# Altium schematic sheet flyback.SchDoc
size Legal; SheetNumber: 4
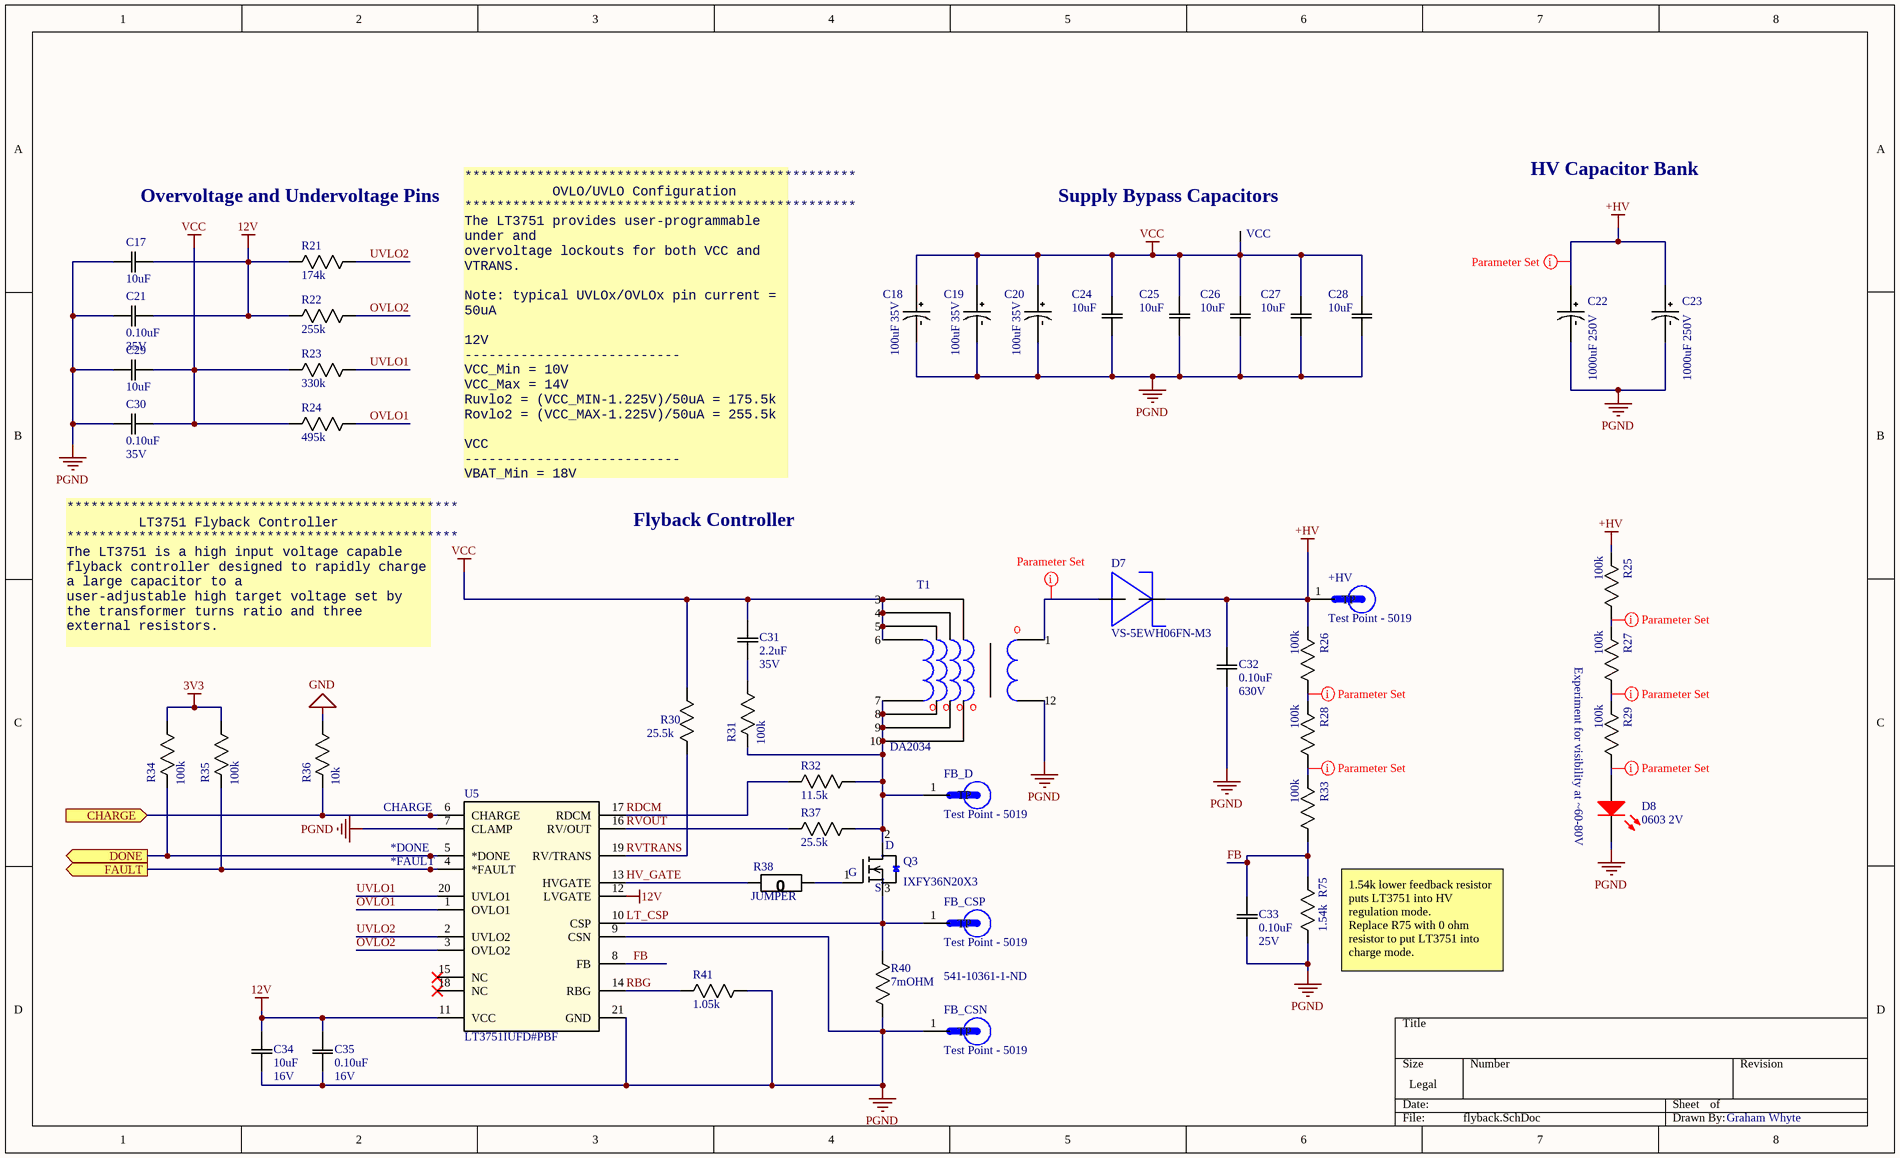
[diagram p0: flyback.SchDoc]

## Parts
*DONE  Test Point (Via)  [TP]  (value not drawn)  (no BOM)
*FAULT  Test Point (Via)  [TP]  (value not drawn)  (no BOM)
+HV  Test Point - 5019  [TP380X203]
C17  10uF  [0805]
C18  100uF 35V  [CAP POL ALU 6.3x5.8]
C19  100uF 35V  [CAP POL ALU 6.3x5.8]
C20  100uF 35V  [CAP POL ALU 6.3x5.8]
C21  Rating: 35V  [0805]  (hidden comment: 0.10uF)
C22  1000uF 250V  [RADIAL, CAN - THRU 25.4mm]
C23  1000uF 250V  [RADIAL, CAN - THRU 25.4mm]
C24  10uF  [0805]
C25  10uF  [0805]
C26  10uF  [0805]
C27  10uF  [0805]
C28  10uF  [0805]
C29  10uF  [0805]
C30  Rating: 35V  [0805]  (hidden comment: 0.10uF)
C31  Rating: 35V  [0603]  (hidden comment: 2.2uF)
C32  Rating: 630V  [1210]  (hidden comment: 0.10uF)
C33  value 0.10uF  Rating: 25V  [0805]  (hidden comment: 0.10uF 25V)
C34  Rating: 16V  [0603]  (hidden comment: 10uF)
C35  Rating: 16V  [0603]  (hidden comment: 0.10uF)
CHARGE  Test Point (Via)  [TP]  (value not drawn)  (no BOM)
D7  VS-5EWH06FN-M3  [DPAK (TO-252)]
D8  0603 2V  [0603 - LED2]
FB_CSN  Test Point - 5019  [TP380X203]
FB_CSP  Test Point - 5019  [TP380X203]
FB_D  Test Point - 5019  [TP380X203]
Q3  IXFY36N20X3  [DPAK (TO-252)]
R21  174k  [0603]
R22  255k  [0603]
R23  330k  [0603]
R24  495k  [0603]
R25  100k  [0603]
R26  100k  [0603]
R27  100k  [0603]
R28  100k  [0603]
R29  100k  [0603]
R30  25.5k  [0603]
R31  100k  [0603]
R32  11.5k  [0603]
R33  100k  [0603]
R34  100k  [0603]
R35  100k  [0603]
R36  10k  [0603]
R37  25.5k  [0603]
R38  JUMPER  [0603]
R40  7mOHM  Supplier Part Number 1: 541-10361-1-ND  [2512]
R41  1.05k  [0603]
R75  1.54k  [0603]
T1  DA2034  [DA2034]
U5  LT3751IUFD#PBF  [QFN-20_UFD_LIT-M]
VCC  Test Point (Via)  [TP]  (value not drawn)  (no BOM)

## Ports
CHARGE (in), DONE (out), FAULT (out)

## Nets
3V3: R34.1(R1) R35.1(R1)
12V: C17.2(C2) C21.2(C2) C34.1(C1) C35.2(C2) R21.2(R2) R22.2(R2) U5.11(VCC) U5.12(LVGATE)
+HV: +HV.1(TP) C22.POS C23.POS C32.1(C1) D7.OUT R25.2(R2) R26.2(R2)
GND: R36.1(R1)
PGND: C17.1(C1) C18.NEG C19.NEG C20.NEG C21.1(C1) C22.NEG C23.NEG C24.1(C1) C25.1(C1) C26.1(C1) C27.1(C1) C28.1(C1) C29.1(C1) C30.1(C1) C32.2(C2) C33.2(C2) C34.2(C2) C35.1(C1) D8.2(K) FB_CSN.1(TP) R40.1(R1) R41.1(R1) R75.1(R1) T1.12 U5.7(CLAMP) U5.9(CSN) U5.21(GND)
VCC: C18.POS C19.POS C20.POS C24.2(C2) C25.2(C2) C26.2(C2) C27.2(C2) C28.2(C2) C29.2(C2) C30.2(C2) C31.2(C2) R23.2(R2) R24.2(R2) R30.1(R1) T1.3 T1.4 T1.5 T1.6 VCC.1
CHARGE: CHARGE.1 R36.2(R2) U5.6(CHARGE) ; port CHARGE
DONE: *DONE.1 R34.2(R2) U5.5(*DONE) ; port DONE
FAULT: *FAULT.1 R35.2(R2) U5.4(*FAULT) ; port FAULT
FB: C33.1(C1) R33.1(R1) R75.2(R2) U5.8(FB)
HV_GATE: R38.2(R2) U5.13(HVGATE)
LT_CSP: FB_CSP.1(TP) Q3.3(S) R40.2(R2) U5.10(CSP)
OVLO1: R24.1(R1) U5.1(OVLO1)
OVLO2: R22.1(R1) U5.3(OVLO2)
RBG: R41.2(R2) U5.14(RBG)
RDCM: R32.2(R2) U5.17(RDCM)
RVOUT: R37.2(R2) U5.16(RV/OUT)
RVTRANS: R30.2(R2) U5.19(RV/TRANS)
UVLO1: R23.1(R1) U5.20(UVLO1)
UVLO2: R21.1(R1) U5.2(UVLO2)
NetC31_1: C31.1(C1) R31.1(R1)
NetD7_IN: D7.IN T1.1
NetD8_1: D8.1(A) R29.1(R1)
NetFB_D_1: FB_D.1(TP) Q3.2(D) R31.2(R2) R32.1(R1) R37.1(R1) T1.7 T1.8 T1.9 T1.10
NetQ3_1: Q3.1(G) R38.1(R1)
NetR25_1: R25.1(R1) R27.2(R2)
NetR26_1: R26.1(R1) R28.2(R2)
NetR27_1: R27.1(R1) R29.2(R2)
NetR28_1: R28.1(R1) R33.2(R2)

Not connected (* = marked no-connect by the designer): U5 15(NC)* 18(NC)*

## Layout directives
net class HighVoltage: +HV, NetD7_IN, NetD8_1, NetR25_1, NetR26_1, NetR27_1, NetR28_1

## Notes on the sheet
- Overvoltage and Undervoltage Pins
- (near VCC) Supply Bypass Capacitors
- HV Capacitor Bank
- *************************************************
  OVLO/UVLO Configuration
  *************************************************
  The LT3751 provides user-programmable under and
  overvoltage lockouts for both VCC and VTRANS.
  Note: typical UVLOx/OVLOx pin current = 50uA
  12V
  ---------------------------
  VCC_Min = 10V
  VCC_Max = 14V
  Ruvlo2 = (VCC_MIN-1.225V)/50uA = 175.5k
  Rovlo2 = (VCC_MAX-1.225V)/50uA = 255.5k
  VCC
  ---------------------------
  VBAT_Min = 18V
  VBAT_Max = 26V
  Ruvlo1 = (VBAT_MIN-1.225V)/50uA = 335.5k
  Rovlo1 = (VBAT_MAX-1.225V)/50uA = 495.5k
- Flyback Controller
- *************************************************
  LT3751 Flyback Controller
  *************************************************
  The LT3751 is a high input voltage capable flyback controller designed to rapidly charge a large capacitor to a
  user-adjustable high target voltage set by the transformer turns ratio and three external resistors.
- Experiment for visibility at ~60-80V
- 1.54k lower feedback resistor puts LT3751 into HV regulation mode.
  Replace R75 with 0 ohm resistor to put LT3751 into charge mode.
- Graham Whyte

## Library data of the parts
+HV FB_CSN FB_CSP FB_D = Test Point - 5019: PC Test Point, Miniature Phosphor Bronze, Silver Plating Surface Mount Mounting Type; MP: 5019; MF: Keystone Electronics; Value: *; Package: 2010 Keystone; Part Number: Test Point - 5019
C17 C24-C29 = CAP 10uF 35V: CAP CER 10UF 35V X7R 0805; Manufacturer Part Number 1: GRM21BR6YA106KE43L; Tolerance: 10%; Temperature Coefficient: X5R; Package: 0805; Value: 10uF; Rating: 35V; Operating Temperature: -55°C ~ 125°C; Part Number: CAP 10uF 35V; Supplier 1: Digi-Key; Supplier Part Number 1: 490-10514-1-ND
C18-C20 = CAP POL 100uF SMD: CAP ALUM 100UF 35V SMD; Tolerance: 20%; Temperature Coefficient: Unspecified; ComponentLink1Description: Digikey Link; ComponentLink1URL: https://www.digikey.ca/product-detail/en/panasonic-electronic-components/ECA-1HM100I/P10425CT-ND/8603345; Package: RADIAL; Value: 100uF; Rating: 35v; Operating Temperature: -40°C ~ 85°C; Dimensions: 0.197" Dia (5.00mm); Part Number: CAP POL 100uF SMD
C21 C30 = CAP 0.10uF 35V: CAP CER 0.10UF 35V X7R 0805; Manufacturer Part Number 1: GMK107B7104KAHT; Tolerance: 10%; Temperature Coefficient: X7R; Value: 0.10uF; Part Number: CAP 0.10uF 35V; Supplier 1: Digi-Key; Supplier Part Number 1: 587-3354-1-ND; Manufacturer Part Number 2: GMK212BJ104KGHT; Supplier 2: Digi-Key; Supplier Part Number 2: 587-3364-1-ND; Package: 0805; Operating Temperature: -55°C ~ 125°C
C22 C23 = CAP POL 1000uF: United Chemi-Con / ESMQ251VSN102MQ45S; Dielectric Material: Aluminium; Capacitance: 1mF; Tolerance: 20%; Lead Diameter: 2mm; Supplier 1: Digi-Key; Manufacturer: United Chemi-Con; Manufacturer Part Number: ESMQ251VSN102MQ45S; RoHS: Yes; Mount: Through Hole,PCB; Number of Pins: 2; Max Operating Temperature: 85°C; Termination: Radial; Voltage: 250V; Diameter: 25.4mm; Height - Seated (Max): 45mm; Lead Pitch: 10mm; REACH SVHC: No SVHC; Supplier Part Number 1: 565-2754-ND; Part Number: CAP POL 1000uF
C31 = CAP 2.2uF 35V: CAP CER 2.2UF 35V X7R 0603/0805; Manufacturer Part Number 1: C1608X5R1V225K080AC; Tolerance: 10%; Temperature Coefficient: X5R; Package: 0603/0805; Operating Temperature: -55°C ~ 125°C; Value: 2.2uF; Part Number: CAP 2.2uF 35V; Supplier 1: Digi-Key; Supplier Part Number 1: 445-8025-1-ND; Manufacturer Part Number 2: CGA4J1X7R1V225K125AE; Supplier 2: Digi-Key; Supplier Part Number 2: 445-8787-1-ND
C32 = CAP 0.10uF 630V: CAP CER 0.1uF 630V X7R 1210; Tolerance: 10%; Package: 1210; Temperature Coefficient: X7R; Operating Temperature: -55°C ~ 125°C; Value: 0.10uF; Part Number: CAP 0.10uF 630V
C33 = CAP 0.10uF 25V: CAP CER 0.10UF 25V X7R 0805; Tolerance: 10%; Temperature Coefficient: X7R; Part Number: CAP 0.10uF 25V; Operating Temperature: -55°C ~ 125°C
C34 = CAP 10uF 16V: CAP CER 10UF 16V X5R 0603/0805; Tolerance: 10%; Package: 0603/0805; Temperature Coefficient: X5R; Operating Temperature: -55°C ~ 85°C; Value: 10uF; Part Number: CAP 10uF 16V
C35 = CAP 0.10uF 16V: CAP CER 0.10UF 16V X5R 0603; Tolerance: 10%; Temperature Coefficient: X5R; Value: 0.10uF; Part Number: CAP 0.10uF 16V; Package: 0603/0805; Operating Temperature: -55°C ~ 85°C
D7 = VS-5EWH06FN-M3: Diode Switching 600V 5A DPAK; pin to pad: IN>3 OUT>2; MF: Vishay Diodes; Digikey: VS-5EWH06FN-M3-ND; Digikey Link: https://www.digikey.ca/en/products/detail/vishay-semiconductor-diodes-division/VS-5EWH06FN-M3/4934509; Part Number: VS-5EWH06FN-M3; Pin Count: 2
D8 = LED RED SMD 0603: 0603 red led alingap 631nm-639nm water clear 18-180mcd 130d; Manufacturer Part Number 1: LTST-C190KRKT; Current Rating: 20mA; Part Number: LED RED SMD 0603; Supplier 1: Digi-Key; Supplier Part Number 1: 160-1436-1-ND; Supplier URL 1: https://www.digikey.ca/en/products/detail/lite-on-inc/LTST-C190KRKT/386817?s=N4IgTCBcDaIIwDYAMBaOAWAzAtKByAIiALoC%2BQA; Pin Count: 2; Voltage Rating - DC: 2V
Q3 = MOSFET N-CH IXFY36N20X3: N-Channel 200 V 36A (Tc) 176W (Tc) Surface Mount TO-252AA; Supplier 1: Digi-Key; Supplier Part Number 1: IXFY36N20X3-ND; Part Number: MOSFET N-CH IXFY36N20X3; Manufacturer Part Number 1: IXFY36N20X3; Supplier URL 1: https://www.digikey.com/en/products/detail/ixys/IXFY36N20X3/7902311
R21 = RES 174k 1/8W: RES SMD 174K OHM 1% 1/8W 0603; Manufacturer: Yageo; Manufacturer Part Number: RC0805FR-07174KL; Temperature Coefficient: 100ppm/°C; Voltage Rating: 150V; RoHS: Yes; Category: Chip SMD Resistors; Max Operating Temperature: 155°C; Tolerance: 1%; Termination: SMD/SMT; Voltage Rating (DC): 150V; Length: 2mm; Height: 0.024inch; Width: 0.049inch; Depth: 1.25mm; ComponentLink1URL: https://datasheet.ciiva.com/2509/pyu-r-int-thick-7-2509472.pdf?src-supplier=Digi-Key; ComponentLink1Description: https://datasheet.ciiva.com/2509/pyu-r-int-thick-7-2509472.pdf?src-supplier=Digi-Key; ComponentLink2URL: https://datasheet.ciiva.com/2509/pyu-r-int-thick-7-2509471.pdf?src-supplier=Digi-Key; ComponentLink2Description: https://datasheet.ciiva.com/2509/pyu-r-int-thick-7-2509471.pdf?src-supplier=Digi-Key; ComponentLink3URL: https://datasheet.ciiva.com/2509/pyu-r-int-thick-7-2509473.pdf?src-supplier=Digi-Key; ComponentLink3Description: https://datasheet.ciiva.com/2509/pyu-r-int-thick-7-2509473.pdf?src-supplier=Digi-Key; Part Number: RES 174k 1/8W
R22 = RES 255k 1/8W - 1%: RES 255k 1/8W - 1% 0603; Part Number: RES 255k 1/8W - 1%
R23 = RES 330k 1/8W - 1%: RES SMD 274K OHM 1% 1/8W 0603; Part Number: RES 330k 1/8W - 1%
R24 = RES 495k 1/8W: RES SMD 495K OHM 1% 1/8W 0603; Manufacturer: Yageo; Manufacturer Part Number: RC0805FR-07499KL; Temperature Coefficient: 100ppm/°C; Voltage Rating (DC): 150V; RoHS: Yes; Category: Chip SMD Resistors; Max Operating Temperature: 155°C; Termination: SMD/SMT; Tolerance: 1%; Voltage Rating: 150V; Length: 2mm; Depth: 1.25mm; ComponentLink1URL: https://datasheet.ciiva.com/15189/getdatasheetpartid-326570-15189975.pdf?src-supplier=Verical; ComponentLink1Description: https://datasheet.ciiva.com/15189/getdatasheetpartid-326570-15189975.pdf?src-supplier=Verical; Part Number: RES 495k 1/8W
R25 R27 R29 R34 R35 = RES 100k 1/8W - 5%: RES SMD 100K OHM 5% 1/8W 0603; Power (Watts): 0.125W; Package: 0805; Value: 100k; Tolerance: 5%; Part Number: RES 100k 1/8W - 5%
R26 R28 R31 R33 = RES 100k 1/8W - 1%: RES SMD 100K OHM 1% 1/8W 0603; Manufacturer Part Number 1: ERJ-H3GJ104V; Power (Watts): 0.125W; Package: 0805; Value: 100k; Tolerance: 1%; Part Number: RES 100k 1/8W - 1%; Supplier 1: Digi-Key; Supplier Part Number 1: 10-ERJ-H3GJ104VCT-ND; Supplier URL 1: https://www.digikey.ca/en/products/detail/panasonic-electronic-components/ERJ-H3GJ104V/13877854?s=N4IgTCBcDaIIwAYC0BRASgKSQCQMwHENEAWANQGEAVJAOQBEQBdAXyA
R30 R37 = RES 25.5k 1/8W: RES SMD 25.5K OHM 0.1% 1/8W 0603; Manufacturer: Panasonic; Manufacturer Part Number: ERA-6AEB2552V; Temperature Coefficient: 25ppm/°C; Voltage Rating: 100V; RoHS: Yes; Category: Chip SMD Resistors; Mount: Surface Mount; Number of Pins: 2; Max Operating Temperature: 155°C; Tolerance: 0.1%; Termination: Solder; Voltage Rating (DC): 100V; Length: 2mm; Height: 0.5mm; Width: 1.25mm; Depth: 1.25mm; ComponentLink1URL: https://datasheet.ciiva.com/11810/0900766b80eb1d8c-11810651.pdf?src-supplier=RSComponents; ComponentLink1Description: https://datasheet.ciiva.com/11810/0900766b80eb1d8c-11810651.pdf?src-supplier=RSComponents; ComponentLink2URL: https://datasheet.ciiva.com/26335/459526-da-01-en-widerstand-0805-era-26335831.pdf?src-supplier=Conrad; ComponentLink2Description: https://datasheet.ciiva.com/26335/459526-da-01-en-widerstand-0805-era-26335831.pdf?src-supplier=Conrad; ComponentLink3URL: https://datasheet.ciiva.com/7870/485442-7870651.pdf?src-supplier=Element14; ComponentLink3Description: https://datasheet.ciiva.com/7870/485442-7870651.pdf?src-supplier=Element14; ComponentLink4URL: https://datasheet.ciiva.com/5987/485442-5987308.pdf?src-supplier=Farnell; ComponentLink4Description: https://datasheet.ciiva.com/5987/485442-5987308.pdf?src-supplier=Farnell; ComponentLink5URL: https://datasheet.ciiva.com/7870/485442-7870652.pdf?src-supplier=Element14; ComponentLink5Description: https://datasheet.ciiva.com/7870/485442-7870652.pdf?src-supplier=Element14; ComponentLink6URL: https://datasheet.ciiva.com/30151/54aoa0000ce26-30151583.pdf?src-supplier=Onlinecomponents.com; ComponentLink6Description: https://datasheet.ciiva.com/30151/54aoa0000ce26-30151583.pdf?src-supplier=Onlinecomponents.com; Part Number: RES 25.5k 1/8W
R32 = RES 11.5k 1/8W: RES SMD 11.5K OHM 0.1% 1/8W 0603 Thin Film; Manufacturer: Panasonic; Manufacturer Part Number: ERA-6AEB1152V; Voltage Rating: 100V; Temperature Coefficient: 25ppm/°C; Supplier 1: Digi-Key; RoHS: Yes; Category: Chip SMD Resistors; Mount: Surface Mount; Number of Pins: 2; Max Operating Temperature: 155°C; Tolerance: 0.1%; Voltage Rating (DC): 100V; Termination: Solder; Length: 2mm; Height: 0.5mm; Width: 1.25mm; Depth: 1.25mm; ComponentLink1URL: https://datasheet.ciiva.com/11810/0900766b80eb1d8c-11810868.pdf?src-supplier=RSComponents; ComponentLink1Description: https://datasheet.ciiva.com/11810/0900766b80eb1d8c-11810868.pdf?src-supplier=RSComponents; ComponentLink2URL: https://datasheet.ciiva.com/41450/001181306-da-01-en-widerstand-era-0805-11k5-0-1-5000st-41450464.pdf?src-supplier=Conrad; ComponentLink2Description: https://datasheet.ciiva.com/41450/001181306-da-01-en-widerstand-era-0805-11k5-0-1-5000st-41450464.pdf?src-supplier=Conrad; ComponentLink3URL: https://datasheet.ciiva.com/5987/485442-5987301.pdf?src-supplier=Farnell; ComponentLink3Description: https://datasheet.ciiva.com/5987/485442-5987301.pdf?src-supplier=Farnell; ComponentLink4URL: https://datasheet.ciiva.com/7829/485442-7829142.pdf?src-supplier=Element14; ComponentLink4Description: https://datasheet.ciiva.com/7829/485442-7829142.pdf?src-supplier=Element14; ComponentLink5URL: https://datasheet.ciiva.com/17211/aoa0000ce26-17211855.pdf?src-supplier=Avnet+Europe; ComponentLink5Description: https://datasheet.ciiva.com/17211/aoa0000ce26-17211855.pdf?src-supplier=Avnet+Europe; ComponentLink6URL: https://datasheet.ciiva.com/7829/485442-7829143.pdf?src-supplier=Element14; ComponentLink6Description: https://datasheet.ciiva.com/7829/485442-7829143.pdf?src-supplier=Element14; Supplier Part Number 1: P11.5KDACT-ND; Part Number: RES 11.5k 1/8W
R36 = RES 10k 1/8W - 5%: RES SMD 10K OHM 5% 1/8W 0603; Power (Watts): 0.125W; Package: 0805; Value: 10k; Tolerance: 5%; Part Number: RES 10k 1/8W - 5%
R38 = RES 0 JUMPER: RES SMD 0 OHM JUMPER GENERIC 0603; Manufacturer Part Number 1: RK73Z1JTTD; Value: 0; Package: 0805; Part Number: RES 0 JUMPER; Tolerance: N/A; Supplier 1: Digi-Key; Supplier Part Number 1: 2019-RK73Z1JTTDCT-ND; Supplier URL 1: https://www.digikey.ca/en/products/detail/koa-speer-electronics-inc/RK73Z1JTTD/9845478
R40 = RES 7m 3W: RES SMD 7m OHM 1% 3W 2512; MFG: VISHAY; Package: 1206; Power (Watts): 3W; Tolerance: 1%; ComponentLink1Description: Digikey Link; ComponentLink1URL: https://www.digikey.com/en/products/detail/vishay-dale/WFMB2512R0500FEA/9972278; Digikey: 541-10282-1-ND; Supplier 1: Digi-Key; Part Number: RES 7m 3W
R41 = RES 1.05k 1/8W: RES SMD 1.05K OHM 0.1% 1/8W 0603; Value: 1.05k; Package: 0805; Tolerance: 0.1%; Part Number: RES 1.05k 1/8W
R75 = RES 1.54k 1_8W - 1%: RES SMD 1.54k OHM 1% 1/8W 0603; Manufacturer Part Number 1: ERJ-3EKF1541V; Power (Watts): 0.125W; Package: 0603; Value: 1.54k; Tolerance: 1%; Supplier 1: Digi-Key; Supplier Part Number 1: P1.54KHDKR-ND; Part Number: RES 1.54k 1_8W - 1%; Supplier URL 1: https://www.digikey.com/en/products/detail/ERJ-3EKF1541V/P1.54KHDKR-ND/576008?curr=usd&utm_campaign=buynow&utm_medium=aggregator&utm_source=octopart
T1 = DA2034: Audio Transformers / Signal Transformers DA2032 Cap Chrgr For Linear LT3750/51; Supplier 1: Mouser; Supplier Part Number 1: 994-DA2034-ALB; Part Number: DA2034
U5 = LT3751IUFD#PBF: IC CTRLR CAP CHRGR 4.75V 20-QFN; Mfr_Name: Analog Devices / Linear Technology; Copyright: Copyright (C) 2021 Ultra Librarian. All rights reserved.; Manufacturer_Part_Number: lt3751iufd#pbf; Digi-Key_Part_Number_1: LT3751IUFD#PBF-ND; RefDes: RefDes; Type: DEV; Supplier 1: Digi-key; Supplier 2: Arrow Electronics; Supplier 3: Mouser; Supplier Part Number 2: LT3751IUFD#PBF; Part Number: LT3751IUFD#PBF; Manufacturer Part Number 1: LT3751IUFD#PBF; Supplier Part Number 1: LT3751IUFD#PBF-ND; Supplier URL 1: https://www.digikey.com/en/products/detail/analog-devices-inc/LT3751IUFD-PBF/2002312
*DONE *FAULT CHARGE VCC = Test Point (Via): Part Number: Test Point (Via)